# Altium schematic sheet chicker.SchDoc
size A4
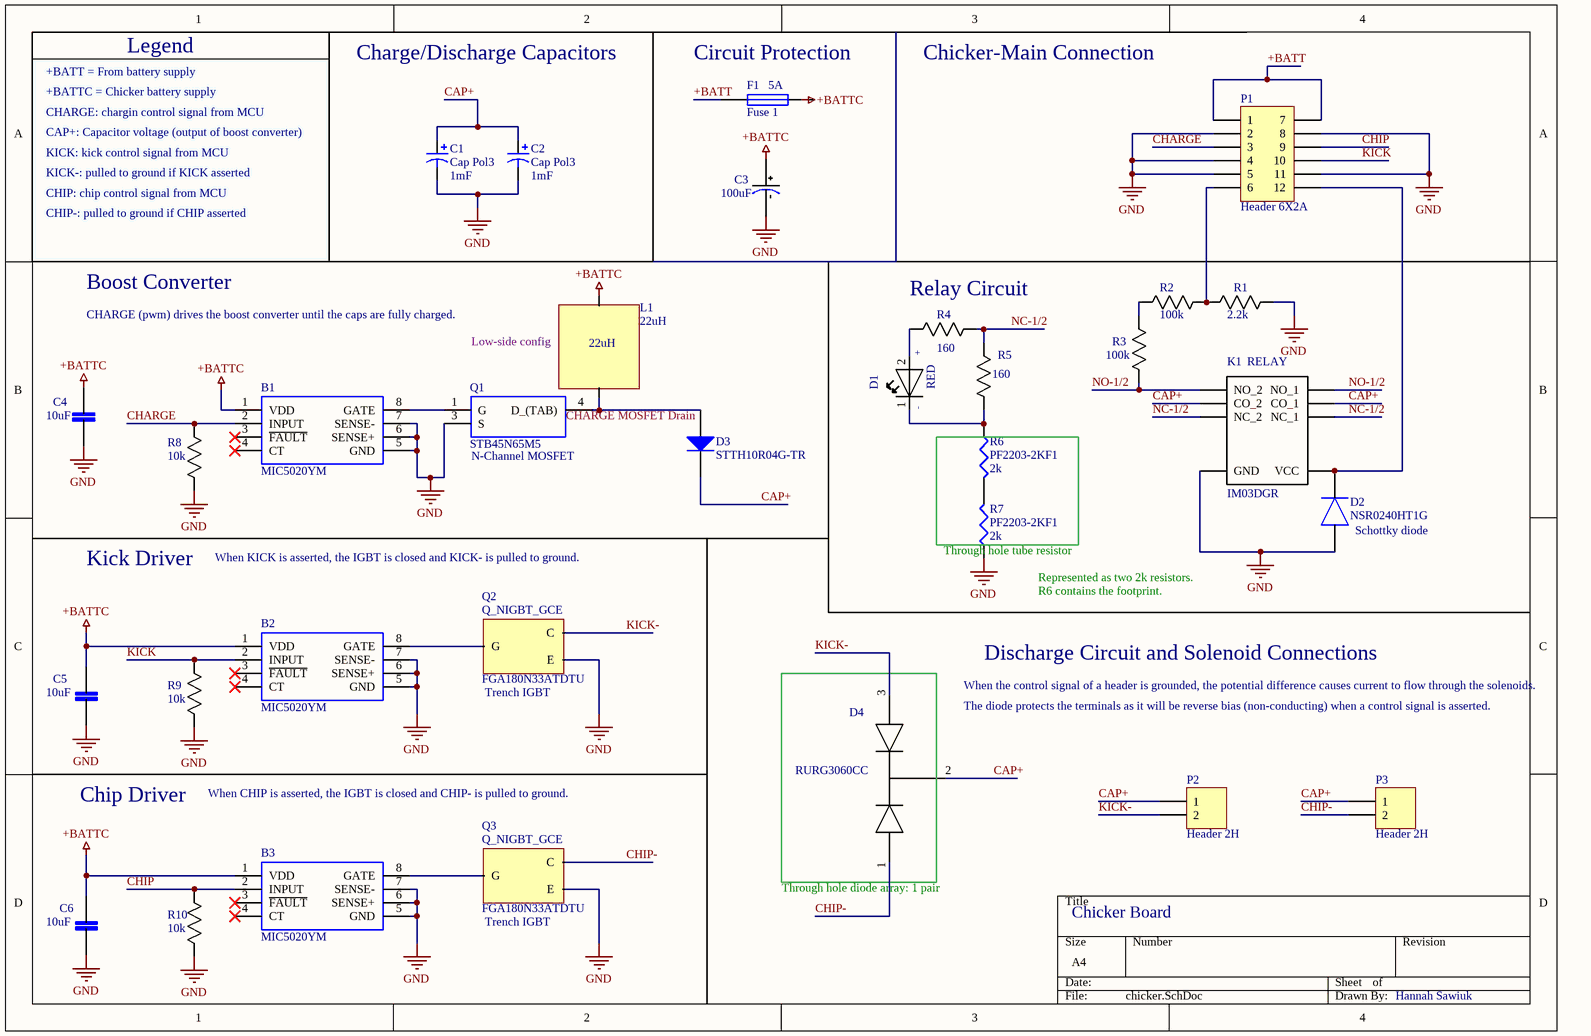
[diagram p0: chicker.SchDoc]

## Parts
B1  MIC5020YM  [SOIC127P600X188-8N]
B2  MIC5020YM  [SOIC127P600X188-8N]
B3  MIC5020YM  [SOIC127P600X188-8N]
C1  Cap Pol3  value 1mF  [C0805]
C2  Cap Pol3  value 1mF  [C0805]
C3  value 100uF  [CAPPRD350W60D800H1150B_ECA-1HM101(Primary)]  (hidden comment: ECA-1HM101)
C4  value 10uF  [CAPC3216X100N]  (hidden comment: CL31A226KOCLFNC)
C5  value 10uF  [CAPC3216X100N]  (hidden comment: CL31A226KOCLFNC)
C6  value 10uF  [CAPC3216X100N]  (hidden comment: CL31A226KOCLFNC)
D1  RED  [WL-SMRW-1206-RECT]
D2  NSR0240HT1G  [SOD2512X110N]
D3  STTH10R04G-TR  [DPAK508P1542X460-3N]
D4  RURG3060CC  [SOT93_TIP147(Primary)]  (value not drawn)
F1  Fuse 1  [FUSM3216X140N]
K1  IM03DGR  value RELAY  [GULLWINGS]
L1  22uH  [PCBComponent_1]
P1  Header 6X2A  [HDR2X6_CEN]
P2  Header 2H  [HDR1X2H]
P3  Header 2H  [HDR1X2H]
Q1  STB45N65M5  [TO254P1542X460-3N]
Q2  FGA180N33ATDTU  [TO-3PN_V_FDA69N25(Primary)]
Q3  FGA180N33ATDTU  [TO-3PN_V_FDA69N25(Primary)]
R1  2.2k  [RESC2013X65N]
R2  value 100k  [RESC2013X65N]
R3  value 100k  [RESC2013X65N]
R4  value 160  [RESC2013X65N]
R5  value 160  [RESC2013X65N]
R6  PF2203-2KF1  value 2k  [POWER_DIODE]
R7  PF2203-2KF1  value 2k
R8  value 10k  [RESC2013X65N]
R9  value 10k  [RESC2013X65N]
R10  value 10k  [RESC2013X65N]

## Nets
+BATTC: B1.1(VDD) B2.1(VDD) B3.1(VDD) C3.POS C4.1 C5.1 C6.1 L1.1
GND: B1.5(GND) B1.6(SENSE+) B1.7(SENSE-) B2.5(GND) B2.6(SENSE+) B2.7(SENSE-) B3.5(GND) B3.6(SENSE+) B3.7(SENSE-) C1.2 C2.2 C3.NEG C4.2 C5.2 C6.2 D2.2(A) K1.8(GND) P1.2 P1.4 P1.5 P1.8 P1.11 Q1.3(S) Q2.3(E) Q3.3(E) R1.1(R1) R7.1 R8.2(R2) R9.2(R2) R10.2(R2)
+BATT: F1.2 P1.1 P1.7
CAP+: C1.1 C2.1 D3.2(K) D4.2 K1.3(CO_1) K1.6(CO_2) P2.1 P3.1
CHARGE: B1.2(INPUT) P1.3 R8.1(R1)
CHIP: B3.2(INPUT) P1.9 R10.1(R1)
CHIP-: D4.1 P3.2 Q3.4(C)
KICK: B2.2(INPUT) P1.10 R9.1(R1)
KICK-: D4.3 P2.2 Q2.4(C)
NC-1/2: K1.2(NC_1) K1.7(NC_2) R4.1(R1) R5.2(R2)
NO-1/2: K1.4(NO_1) K1.5(NO_2) R3.1(R1)
NetB1_8: B1.8(GATE) Q1.1(G)
NetB2_8: B2.8(GATE) Q2.G
NetB3_8: B3.8(GATE) Q3.G
NetD1_1: D1.1(NEG) R5.1(R1) R6.1
NetD1_2: D1.2(POS) R4.2(R2)
NetD2_1: D2.1(K) K1.1(VCC) P1.12
NetD3_1: D3.1(A) L1.0 Q1.4(D_(TAB))
NetP1_6: P1.6 R1.2(R2) R2.2(R2)
NetR2_1: R2.1(R1) R3.2(R2)
NetR6_2: R6.2 R7.2

Not connected (* = marked no-connect by the designer): B1 3(~{FAULT})* 4(CT)*; B2 3(~{FAULT})* 4(CT)*; B3 3(~{FAULT})* 4(CT)*; F1 1

## Notes on the sheet
- +BATT = From battery supply
- +BATTC = Chicker battery supply
- CHARGE: chargin control signal from MCU
- Legend
- Charge/Discharge Capacitors
- (near F1) Circuit Protection
- (near F1) 5A
- Chicker-Main Connection
- CAP+: Capacitor voltage (output of boost converter)
- KICK: kick control signal from MCU
- KICK-: pulled to ground if KICK asserted
- CHIP: chip control signal from MCU
- CHIP-: pulled to ground if CHIP asserted
- Boost Converter
- (near R4) Relay Circuit
- CHARGE (pwm) drives the boost converter until the caps are fully charged.
- (near L1) Low-side config
- (near Q1) CHARGE MOSFET Drain
- (near Q1) N-Channel MOSFET
- Kick Driver
- When KICK is asserted, the IGBT is closed and KICK- is pulled to ground.
- (near R7) Through hole tube resistor
- Represented as two 2k resistors.
- (near D2) Schottky diode
- R6 contains the footprint.
- (near Q2) Trench IGBT
- (near D4) The diode protects the terminals as it will be reverse bias (non-conducting) when a control signal is asserted.
- (near D4) When the control signal of a header is grounded, the potential difference causes current to flow through the solenoids.
- (near D4) Discharge Circuit and Solenoid Connections
- Chip Driver
- When CHIP is asserted, the IGBT is closed and CHIP- is pulled to ground.
- (near Q3) Trench IGBT
- (near D4) Through hole diode array: 1 pair
- Chicker Board
- Hannah Sawiuk
- Labels drawn without touching a wire or pin: +BATTC
- (in symbol FGA180N33ATDTU) Q_NIGBT_GCE
- (in symbol WL-SMRW) +; -

## Library data of the parts
B1-B3 = MIC5020YM: Low-Side Gate Driver IC Non-Inverting 8-SOIC; MP: Microchip; Geometry.Height: 1.879mm; MF: MIC5020YM; Arrow Part Number: MIC5020YM; Arrow Price/Stock: https://www.arrow.com/en/products/mic5020ym/microchip-technology; Datasheet Link: http://ww1.microchip.com/downloads/en/devicedoc/mic5020.pdf; Digi-Key_Part_Num: 576-1818-5-ND; Digi-Key_Link: https://www.digikey.ca/products/en?keywords=576-1818-5-ND; Package: 8-SOIC (0.154", 3.90mm Width)
C1 C2 = Cap Pol3: Polarized Capacitor (Surface Mount); MF: United Chemi-Con; MP: ESMQ251VSN102MQ45S; PackageReference: C0805; PackageDescription: Chip Capacitor; Digi-Key_Link: https://www.digikey.ca/products/en?keywords=565-2754-ND; Digi-Key_Part_Num: 565-2754-ND
C3 = ECA-1HM101: CAP ALUM 100UF 20% 50V RADIAL; MF: Panasonic; SnapEDA_Link: https://www.snapeda.com/parts/ECA-1HM101/Panasonic%20Electronic%20Components/view-part/?ref=snap; Availability: Good; MP: ECA-1HM101; Package: Radial Panasonic; Digi-Key_Part_Num: P5182-ND; Digi-Key_Link: https://www.digikey.ca/products/en?keywords=P5182-ND
C4-C6 = CL31A226KOCLFNC: CAP CER 10UF 25V X5R 1206; MF: Samsung; MP: CL31A106KAHNNNE; SnapEDA_Link: https://www.snapeda.com/parts/CL31A226KOCLFNC/Samsung%20Electro-Mechanics/view-part/?ref=snap; Package: 1206 Samsung; Digi-Key_Part_Num: 1276-1075-1-ND; Digi-Key_Link: https://www.digikey.ca/products/en?keywords=1276-1075-1-ND
D1 = WL-SMRW: LED RED CLEAR 1206 SMD; MF: Lite-On Inc.; MP: LTST-C150CKT; SnapEDA_Link: https://www.snapeda.com/parts/156120YS75000/Wurth%20Electronics%20Inc/view-part/?ref=snap; Availability: Good; Package: 1206; Value: *; Digi-Key_Part_Num: 160-1167-1-ND; Digi-Key_Link: https://www.digikey.ca/products/en?keywords=160-1167-1-ND
D2 = NSR0240HT1G: SMT Schottky Diode, 40V dc 250mA, 3ns, 2-pin SOD-323; MF: ON Semiconductor; Allied_Number: 70341267; Geometry.Height: 1.1mm; MP: NSR0240HT1G; RS Part Number: 7931024P; RS Price/Stock: http://uk.rs-online.com/web/p/products/7931024P; Allied Price/Stock: http://www.alliedelec.com/on-semiconductor-nsr0240ht1g/70341267/; Arrow Part Number: NSR0240HT1G; Arrow Price/Stock: https://www.arrow.com/en/products/nsr0240ht1g/on-semiconductor; Datasheet Link: http://www.onsemi.com/pub/Collateral/NSR0240H-D.PDF; Digi-Key_Part_Num: NSR0240HT1GOSCT-ND; Digi-Key_Link: https://www.digikey.ca/products/en?keywords=NSR0240HT1GOSCT-ND
D3 = Diode 1N914: DIODE GEN PURP 400V 10A D2PAK; MF: STMicroelectronics; Digi-Key_Part_Num: 497-7575-1-ND; Digi-Key_Link: https://www.digikey.ca/products/en?keywords=497-7575-1-ND; MP: STTH10R04G-TR; Package: TO-263-3, D2PAK
D4 = RURG3060CC: DIODE ARRAY GP 600V 30A TO247; MF: On Semiconductor; Digi-Key_Part_Num: RURG3060CC-ND; Digi-Key_Link: https://www.digikey.ca/product-detail/en/on-semiconductor/RURG3060CC/RURG3060CC-ND/458782; MP: RURG3060CC; Package: TO-247-3; Mounting: Through Hole
F1 = Fuse 1: FUSE BOARD MOUNT 5A 32VDC 1206; MF: Littelfuse Inc.; MP: 0469005.WR; Digi-Key_Part_Num: F3539CT-ND; Digi-Key_Link: https://www.digikey.ca/products/en?keywords=F3539CT-ND; Package: 1206
K1 = IM03DGR: Relay, Signal, Dpdt, 250vac, 220vdc, 5a; MF: TE Connectivity; Package: None; Availability: Bad; MP: IM03DGR; Mouse_Link: https://ca.mouser.com/ProductDetail/TE-Connectivity-Axicom/IM03DGR?qs=%2fha2pyFaduiF1fFPF6khDaDmW4QDr7NXlTj5CREuzvY%3d; Mouser_Part_Num: 655-IM03DGR
L1 = Inductor 22uH
P1 = Header 6X2A: Header, 6-Pin, Dual row; MF: Sullins Connector Solutions; MP: PBC06DAAN; Publisher: Altium Limited; Digi-Key_Part_Num: S2011E-06-ND; Digi-Key_Link: https://www.digikey.ca/product-detail/en/sullins-connector-solutions/PBC06DAAN/S2011E-06-ND/861064
P2 P3 = Header 2H: 2 Positions Header Connector 0.100" (2.54mm) Through Hole, Right Angle Tin; MF: Molex, LLC; Digi-Key_Part_Num: WM4300-ND; Digi-Key_Link: https://www.digikey.ca/products/en?keywords=WM4300-ND; MP: 22-05-3021
Q1 = STB45N65M5: MOSFET N CH 650V 35A D2PAK; MF: STMicroelectronics; Allied_Number: 70390681; Geometry.Height: 4.6mm; MP: STB45N65M5; Allied Price/Stock: http://www.alliedelec.com/stmicroelectronics-stb45n65m5/70390681/; Arrow Part Number: STB45N65M5; Datasheet Link: http://www.st.com/web/en/resource/technical/document/datasheet/DM00049184.pdf; Digi-Key_Part_Num: 497-12940-1-ND; Digi-Key_Link: https://www.digikey.ca/products/en?keywords=497-12940-1-ND
Q2 Q3 = FGA180N33ATDTU: IGBT Trench 330V 180A 390W Through Hole TO-3P; MF: ON Semiconductor; Digi-Key_Part_Num: FGA180N33ATDTU-ND; Digi-Key_Link: https://www.digikey.ca/product-detail/en/on-semiconductor/FGA180N33ATTU/FGA180N33ATTU-ND/1916865; MP: FGA180N33ATDTU; Package: TO-3P-3, SC-65-3; Mouting: Through Hole
R1 = RC0805FR-072K2L: RES SMD 2.2K OHM 1% 1/8W 0805; MF: Yageo; Availability: Good; Package: 0805 Yageo; MP: RC0805FR-072K2L; SnapEDA_Link: https://www.snapeda.com/parts/RC0805FR-072K2L/Yageo/view-part/?ref=snap; Value: 2.2k; Digi-Key_Link: https://www.digikey.ca/products/en?keywords=311-2.20KCRCT-ND; Digi-Key_Part_Num: 311-2.20KCRCT-ND
R2 R3 = RC0805FR-072K2L: RES SMD 100K OHM 1% 1/8W 0805; MP: RC0805FR-07100KL; MF: Yageo; Availability: Good; Package: 0805 Yageo; SnapEDA_Link: https://www.snapeda.com/parts/RC0805FR-072K2L/Yageo/view-part/?ref=snap; Digi-Key_Link: https://www.digikey.ca/products/en?keywords=311-100KCRCT-ND; Digi-Key_Part_Num: 311-100KCRCT-ND
R4 R5 = RC0805FR-072K2L: RES SMD 160 OHM 1% 1/8W 0805; MP: RC0805FR-07160RL; MF: Yageo; Availability: Good; Package: 0805 Yageo; SnapEDA_Link: https://www.snapeda.com/parts/RC0805FR-072K2L/Yageo/view-part/?ref=snap; Digi-Key_Link: https://www.digikey.ca/products/en?keywords=311-160CRCT-ND; Digi-Key_Part_Num: 311-160CRCT-ND
R6 R7 = Res3: RES 2K OHM 35W 1% TO220; MF: Riedon; Published: 8-Jun-2000; LatestRevisionDate: 29-May-2009; LatestRevisionNote: IPC-7351 Footprint Added.; Publisher: Altium Limited; Digi-Key_Link: https://www.digikey.ca/products/en?keywords=696-1170-ND; Digi-Key_Part_Num: 696-1170-ND; MP: PF2203-2KF1
  R6: Package: TO-220-2
  R7: PackageReference: J1-0603; PackageDescription: Chip Resistor
R8-R10 = RC0805FR-072K2L: RES SMD 10K OHM 1% 1/8W 0805; MP: RC0805FR-0710KL; MF: Yageo; Availability: Good; Package: 0805 Yageo; SnapEDA_Link: https://www.snapeda.com/parts/RC0805FR-072K2L/Yageo/view-part/?ref=snap; Digi-Key_Link: https://www.digikey.ca/products/en?keywords=311-10.0KCRCT-ND; Digi-Key_Part_Num: 311-10.0KCRCT-ND